# Altium project MHE_Tracker_V2.PrjPcb
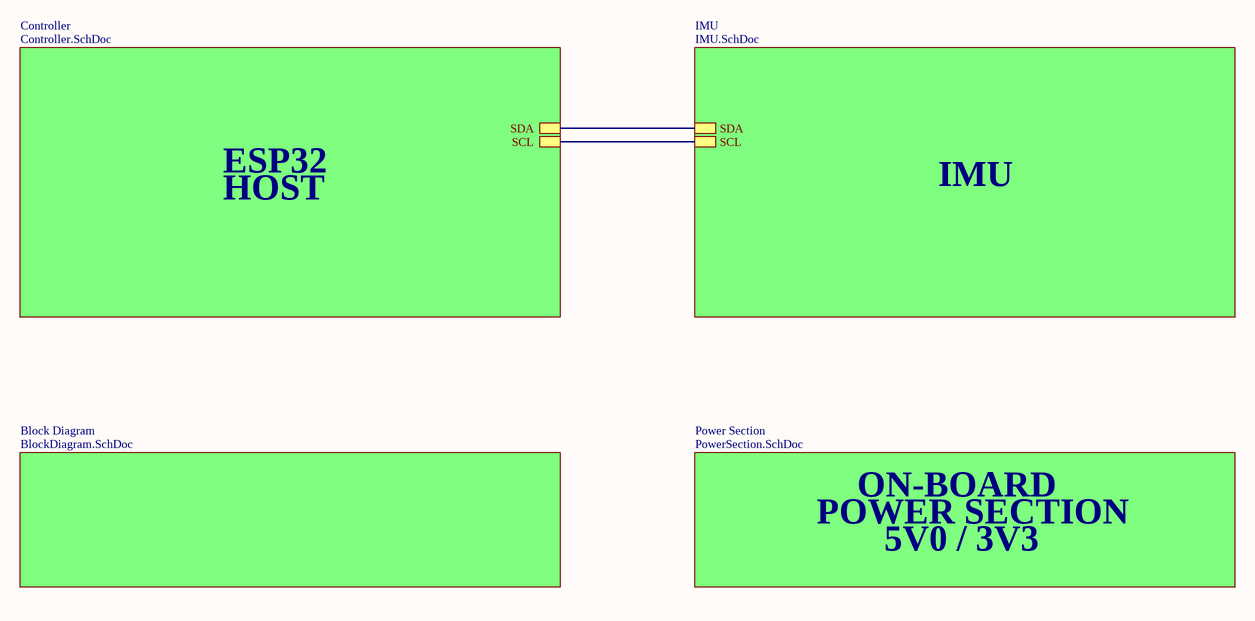
[diagram p0: Architecture.SchDoc]
Project: MHE Tracker V2; Revision: 1.0; SheetTotal: 5
4 sheets, 117 parts. Net scope: hierarchical (ports join the sheet entries above them; power ports are global).
Board file: MHE_Tracker_V2.PcbDoc
Sheets:
  Architecture.SchDoc
    Controller = Controller.SchDoc
    Power Section = PowerSection.SchDoc
    IMU = IMU.SchDoc

## Sheet Architecture.SchDoc: System Architecture
size 420 x 297 mm; SheetNumber: 1; SheetTotal: 2; DOC_NO_SCH_DWG: 1

### Sub-sheets
Block Diagram = BlockDiagram.SchDoc (file not in this document): no entries
Controller = Controller.SchDoc: SDA, SCL
IMU = IMU.SchDoc: SDA, SCL
Power Section = PowerSection.SchDoc: no entries

### Nets
SCL: sheet Controller/SCL, sheet IMU/SCL
SDA: sheet Controller/SDA, sheet IMU/SDA

### Notes on the sheet
- HOST
- ESP32
- IMU
- POWER SECTION
- ON-BOARD
- 5V0 / 3V3
- PROJECT
- SIZE
- FILE NAME
- A3
- TITLE
- SHEET
- OF
- REV

## Sheet Controller.SchDoc: Controller Section
size 420 x 297 mm; SheetNumber: 2
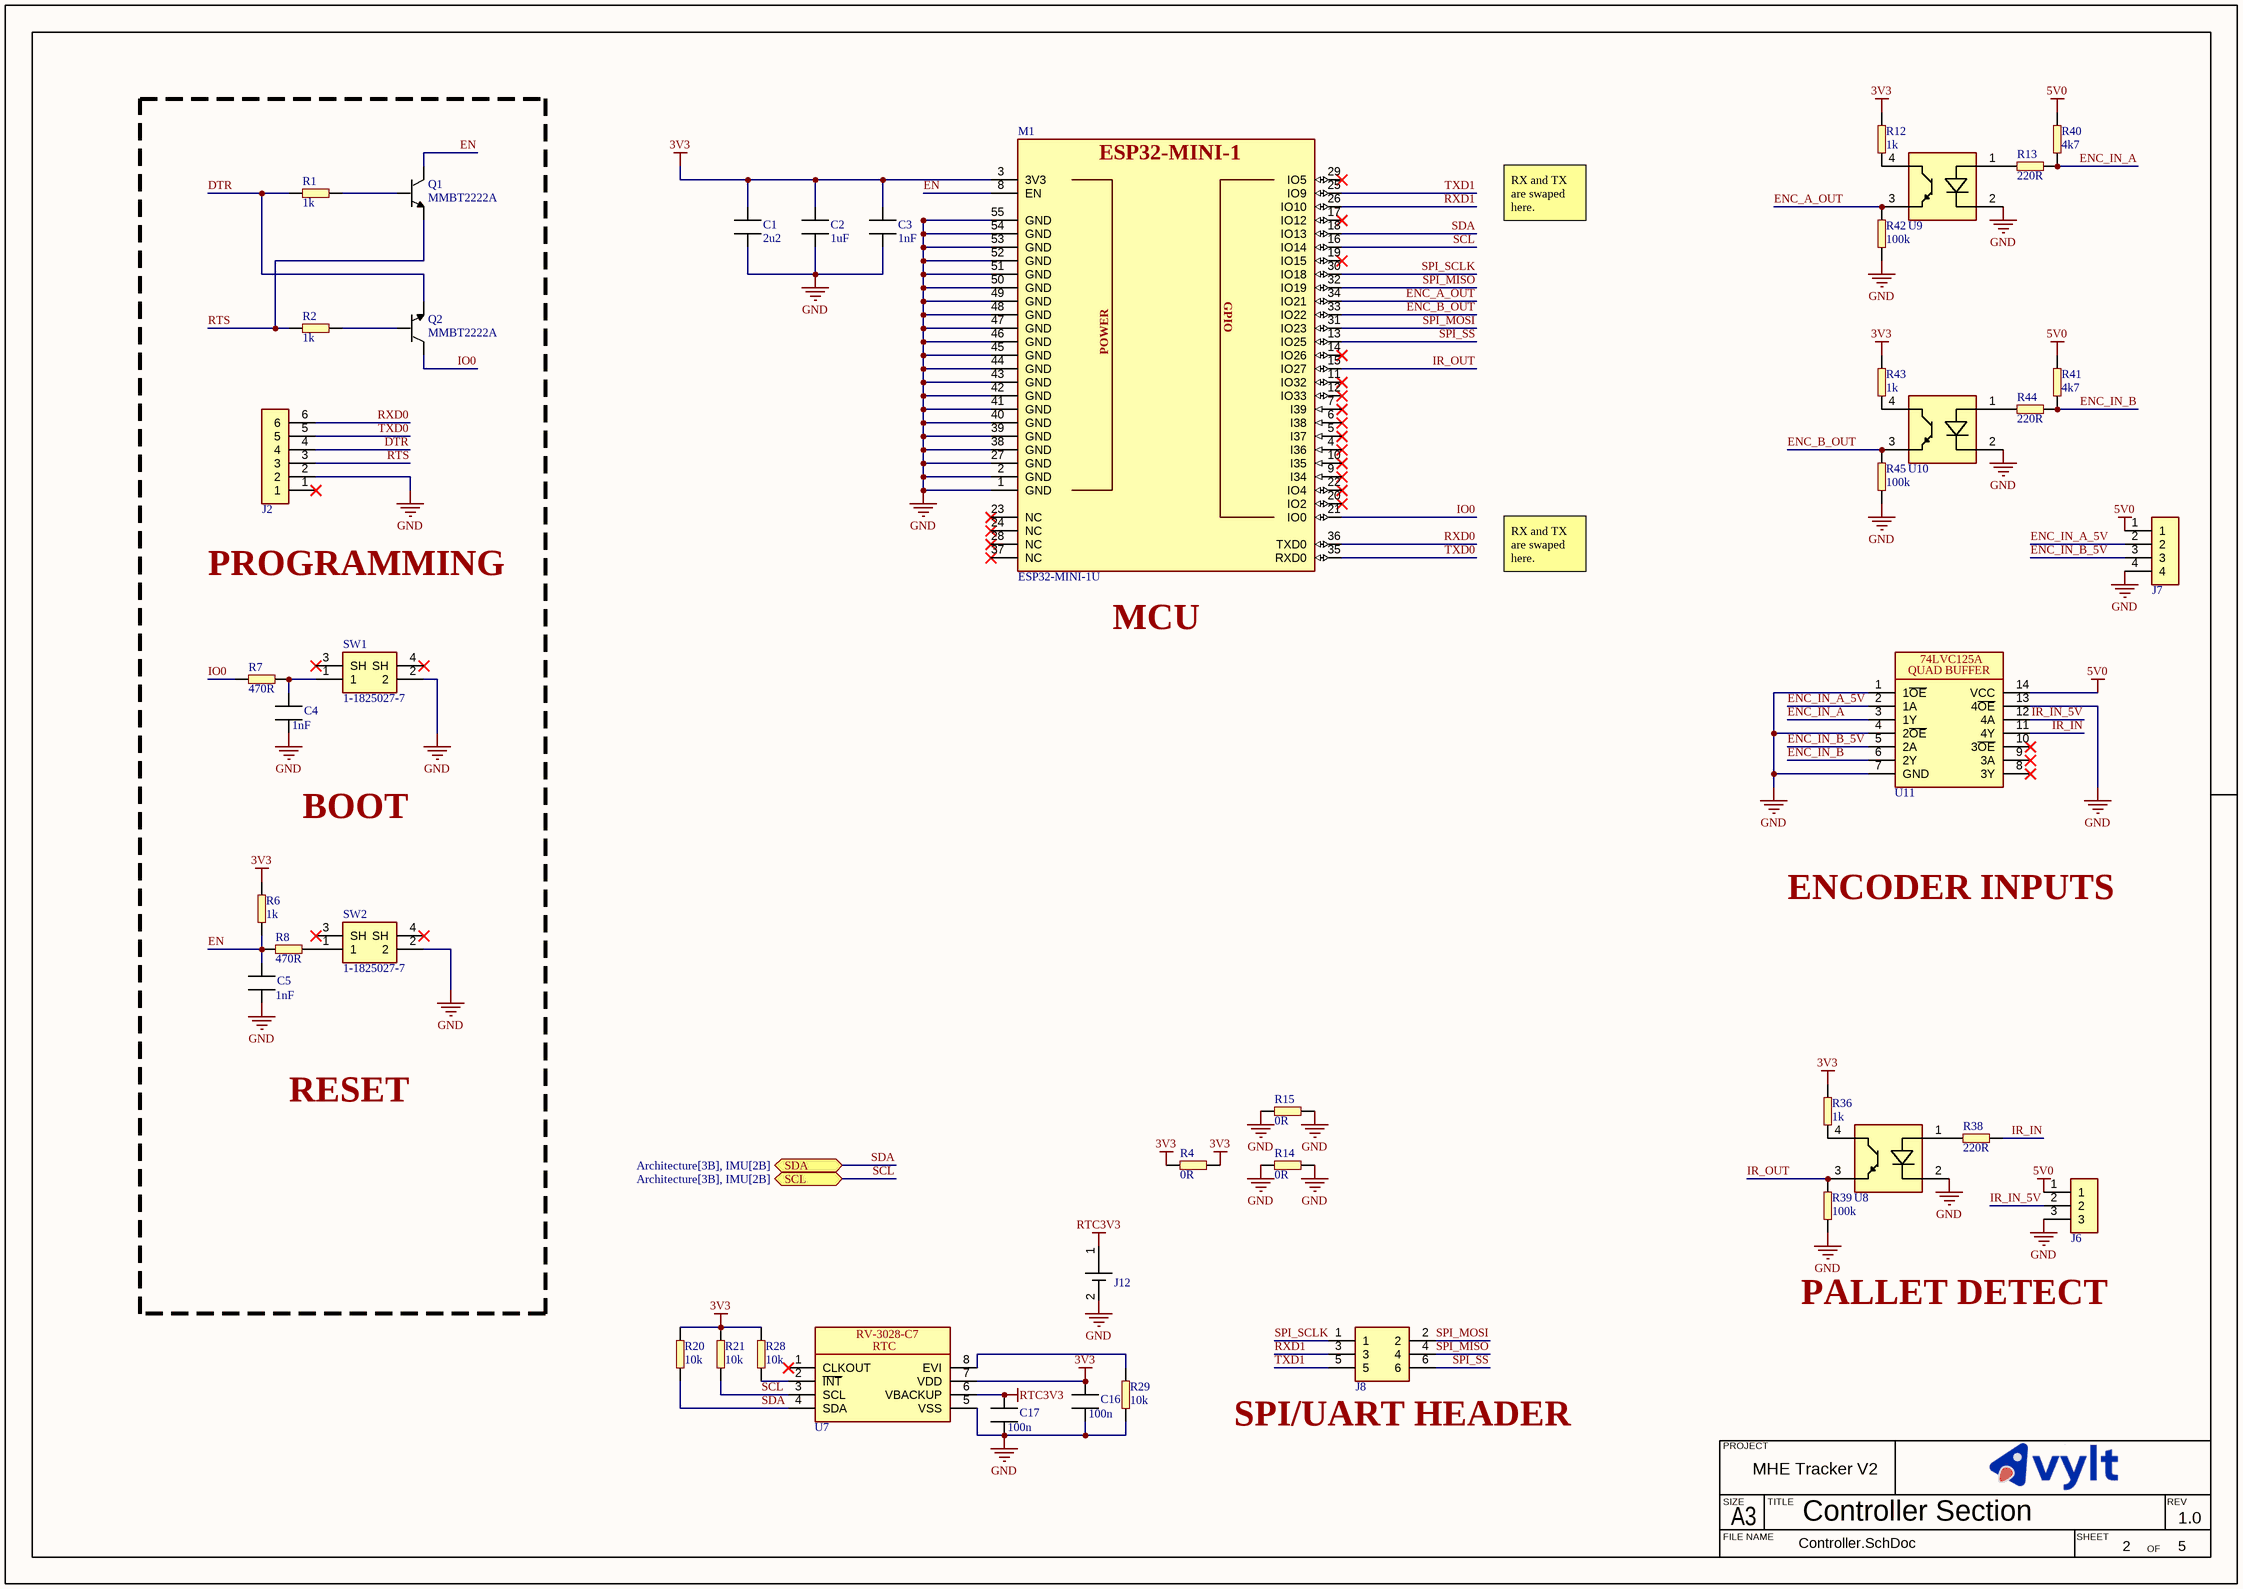
[diagram p1: Controller.SchDoc]

### Parts
(Parts that share a designator on the sheet are numbered #1, #2 ... from top to bottom, then left to right.)
C1  value 2u2  [CAPC1608X10N]  (hidden comment: ERP_102-1)
C2  value 1uF  [CAPC1608X10N]  (hidden comment: ERP_102-1)
C3  value 1nF  [CAPC1608X10N]  (hidden comment: ERP_102-1)
C4  value 1nF  [CAPC1608X10N]  (hidden comment: ERP_102-1)
C5  value 1nF  [CAPC1608X10N]  (hidden comment: ERP_102-1)
C16  value 100n  [CAPC1608X10N]  (hidden comment: ERP_102-1)
C17  value 100n  [CAPC1608X10N]  (hidden comment: ERP_102-1)
J2  ERP_148-2  [6PX1R]  (value not drawn)  (no BOM)
J6#1  Terminal_Block_3Pin_2.54P  [Terminal_Block_3Pin_2.54P]  (value not drawn)
J7#1  Terminal_Block_4Pin_2.54P  [Terminal_Block_4Pin_2.54P]  (value not drawn)
J8#1  6X2_1P27_MH_TH  [6X2_1P27_MH_TH]  (value not drawn)  (no BOM)
J12  CR1220-BH  [CR1220-BH]  (value not drawn)
M1  value ESP32-MINI-1U  [ESP32_MINI_1U]  (hidden comment: ERP_140-3)
Q1  value MMBT2222A  [MMBT2222]  (hidden comment: ERP_105-1)
Q2  value MMBT2222A  [MMBT2222]  (hidden comment: ERP_105-1)
R1  value 1k  [RES_0603]  (hidden comment: ERP_101-1)
R2  value 1k  [RES_0603]  (hidden comment: ERP_101-1)
R4  value 0R  [RESC3115X06N]  (hidden comment: ERP_101-1)
R6  value 1k  [RES_0603]  (hidden comment: ERP_101-1)
R7  value 470R  [RES_0603]  (hidden comment: ERP_101-1)
R8  value 470R  [RES_0603]  (hidden comment: ERP_101-1)
R12  value 1k  [RES_0603]  (hidden comment: ERP_101-1)
R13  value 220R  [RES_0603]  (hidden comment: ERP_101-1)
R14  value 0R  [RESC3115X06N]  (hidden comment: ERP_101-1)
R15  value 0R  [RESC3115X06N]  (hidden comment: ERP_101-1)
R20  value 10k  [RES_0603]  (hidden comment: ERP_101-1)
R21  value 10k  [RES_0603]  (hidden comment: ERP_101-1)
R28  value 10k  [RES_0603]  (hidden comment: ERP_101-1)
R29  value 10k  [RES_0603]  (hidden comment: ERP_101-1)
R36  value 1k  [RES_0603]  (hidden comment: ERP_101-1)
R38  value 220R  [RES_0603]  (hidden comment: ERP_101-1)
R39  value 100k  [RES_0603]  (hidden comment: ERP_101-1)
R40  value 4k7  [RES_0603]  (hidden comment: ERP_101-1)
R41  value 4k7  [RES_0603]  (hidden comment: ERP_101-1)
R42  value 100k  [RES_0603]  (hidden comment: ERP_101-1)
R43  value 1k  [RES_0603]  (hidden comment: ERP_101-1)
R44  value 220R  [RES_0603]  (hidden comment: ERP_101-1)
R45  value 100k  [RES_0603]  (hidden comment: ERP_101-1)
SW1  value 1-1825027-7  [FSM_6X6]  (hidden comment: ERP_110-4)
SW2  value 1-1825027-7  [FSM_6X6]  (hidden comment: ERP_110-4)
U7  RV-3028-C7  [RV-3028-C7]  (value not drawn)
U8  FOD817A3SD  [FOD817A3SD]  (value not drawn)
U9  FOD817A3SD  [FOD817A3SD]  (value not drawn)
U10  FOD817A3SD  [FOD817A3SD]  (value not drawn)
U11  74LVC125ABQ  [74LVC125ABQ]  (value not drawn)

### Ports
SCL (bidir, see Architecture[3B], IMU[2B]), SDA (bidir, see Architecture[3B], IMU[2B])

### Nets
3V3: C1.2 C2.2 C3.2 C16.1 M1.3(3V3) R4.1 R4.2 R6.2 R12.2 R20.2 R21.2 R28.2 R36.2 R43.2 U7.7(VDD)
5V0: J6#1.1 J7#1.1 R40.2 R41.2 U11.14(VCC)
GND: C1.1 C2.1 C3.1 C4.2 C5.2 C16.2 C17.2 J2.2 J6#1.3 J7#1.4 J12.2(-) M1.1(GND) M1.2(GND) M1.27(GND) M1.38(GND) M1.39(GND) M1.40(GND) M1.41(GND) M1.42(GND) M1.43(GND) M1.44(GND) M1.45(GND) M1.46(GND) M1.47(GND) M1.48(GND) M1.49(GND) M1.50(GND) M1.51(GND) M1.52(GND) M1.53(GND) M1.54(GND) M1.55(GND) R14.1 R14.2 R15.1 R15.2 R29.1 R39.1 R42.1 R45.1 SW1.2 SW2.2 U7.5(VSS) U8.2(CATHODE) U9.2(CATHODE) U10.2(CATHODE) U11.1(1~{OE}) U11.4(2~{OE}) U11.7(GND) U11.13(4~{OE})
RTC3V3: C17.1 J12.1(+) U7.6(VBACKUP)
DTR: J2.4 Q2.2 R1.2
EN: C5.1 M1.8(EN) Q1.3 R6.1 R8.2
ENC_A_OUT: M1.34(IO21) R42.2 U9.3(EMITTER)
ENC_B_OUT: M1.33(IO22) R45.2 U10.3(EMITTER)
ENC_IN_A: R13.2 R40.1 U11.3(1Y)
ENC_IN_A_5V: J7#1.2 U11.2(1A)
ENC_IN_B: R41.1 R44.2 U11.6(2Y)
ENC_IN_B_5V: J7#1.3 U11.5(2A)
IO0: M1.21(IO0) Q2.3 R7.2
IR_IN: R38.2 U11.11(4Y)
IR_IN_5V: J6#1.2 U11.12(4A)
IR_OUT: M1.15(IO27) R39.2 U8.3(EMITTER)
RTS: J2.3 Q1.2 R2.2
RXD0: J2.6 M1.36(TXD0)
RXD1: J8#1.3 M1.26(IO10)
SCL: M1.16(IO14) R21.1 U7.3(SCL) ; port SCL
SDA: M1.18(IO13) R20.1 U7.4(SDA) ; port SDA
SPI_MISO: J8#1.4 M1.32(IO19)
SPI_MOSI: J8#1.2 M1.31(IO23)
SPI_SCLK: J8#1.1 M1.30(IO18)
SPI_SS: J8#1.6 M1.13(IO25)
TXD0: J2.5 M1.35(RXD0)
TXD1: J8#1.5 M1.25(IO9)
NetC4_1: C4.1 R7.1 SW1.1
NetQ1_1: Q1.1 R1.1
NetQ2_1: Q2.1 R2.1
NetR8_1: R8.1 SW2.1
NetR12_1: R12.1 U9.4(COLLECTOR)
NetR13_1: R13.1 U9.1(ANODE)
NetR28_1: R28.1 U7.2(~{INT})
NetR29_2: R29.2 U7.8(EVI)
NetR36_1: R36.1 U8.4(COLLECTOR)
NetR38_1: R38.1 U8.1(ANODE)
NetR43_1: R43.1 U10.4(COLLECTOR)
NetR44_1: R44.1 U10.1(ANODE)

Not connected (* = marked no-connect by the designer): J2 1*; M1 4(I36)* 5(I37)* 6(I38)* 7(I39)* 9(I34)* 10(I35)* 11(IO32)* 12(IO33)* 14(IO26)* 17(IO12)* 19(IO15)* 20(IO2)* 22(IO4)* 23(NC)* 24(NC)* 28(NC)* 29(IO5)* 37(NC)*; SW1 3(SH)* 4(SH)*; SW2 3(SH)* 4(SH)*; U7 1(CLKOUT)*; U11 8(3Y)* 9(3A)* 10(3~{OE})*

### Notes on the sheet
- RX and TX are swaped here.
- PROGRAMMING
- (near M1) MCU
- BOOT
- ENCODER INPUTS
- RESET
- PALLET DETECT
- (near J8#1) SPI/UART HEADER
- PROJECT
- SIZE
- FILE NAME
- A3
- TITLE
- SHEET
- OF
- REV
- (in symbol 74LVC125ABQ) 74LVC125A; QUAD BUFFER
- (in symbol ESP32_MINI_1) ESP32-MINI-1; GPIO; POWER
- (in symbol RV-3028-C7) RTC

### Library data of the parts
C1 = MLCC_0603: MLCC 0603; Manufacturer 1: Murata Electronics; Manufacturer Part Number 1: GRT188R61H225KE13D; Package: 0603; Suuplier Part Number 1: *; ERP: *; Supplier 1: Digikey; Supplier Part Number 1: 490-12332-1-ND
C2 = MLCC_0603: MLCC 0603; Manufacturer 1: Samsung Electro-Mechanics; Manufacturer Part Number 1: CL10A105KB8NNNC; Package: 0603; Supplier 1: *; Suuplier Part Number 1: *; ERP: *
C3-C5 = MLCC_0603: MLCC 0603; Manufacturer 1: Samsung Electro-Mechanics; Manufacturer Part Number 1: CL10C102JB8NNNC; Package: 0603; Suuplier Part Number 1: *; ERP: *; Supplier 1: Digikey; Supplier Part Number 1: 1276-1091-1-ND
C16 C17 = MLCC_0603: MLCC 0603; Package: 0603; Manufacturer Part Number 1: *; Suuplier Part Number 1: *; ERP: *
  C17: Manufacturer 1: *
J2 = 6PX1R
J6#1 = Terminal_Block_3Pin_2.54P: TERMINAL BLOCK 3 PIN 2.54 PITCH; Manufacturer Part Number 1: *; Manufacturer 1: *; Value: *
J7#1 = Terminal_Block_4Pin_2.54P: TERMINAL BLOCK 4 PIN 2.54 PITCH; Manufacturer Part Number 1: *; Manufacturer 1: *; Value: *
J8#1 = 6X2_1P27_MH_TH: Manufacturer Part Number 1: HPH2-A-06-UA; Manufacturer 1: Adam Tech; Value: *
J12 = CR1220-BH: BATTERY HOLDER COIN 12.5MM SMD; Manufacturer 1: Keystone Electronics; Value: *; Manufacturer Part Number 1: *
M1 = ESP32_MINI_1: ESP32_C3_MINI_1 Module; Manufacturer Part Number 1: ESP32-MINI-1U-N4; Manufacturer 1: Espressif Systems; ERP: *; Package: 56 PIN SMD; Supplier 1: Digikey; Supplier Part Number 1: 1965-ESP32-MINI-1U-N4CT-ND
Q1 Q2 = MMBT2222: MMBT2222A; Manufacturer Part Number 1: MMBT2222A-7-F; Manufacturer 1: Diotec Semiconductor; ERP: *; Suuplier Part Number 1: *; Supplier 1: *; Package: SOT23
R1 R2 R6 R12 R13 R36 R38 R40 R41 R43 R44 = RES_0603: Manufacturer 1: YAGEO; Manufacturer Part Number 1: RC0603FR-071KL; Package: 0603; ERP: *
R4 R14 R15 = RES_1206: Package: 1206; Manufacturer 1: *; Manufacturer Part Number 1: *; Supplier  1: *; Supplier  Part Number 1: *; ERP: *
R7 R8 = RES_0603: Manufacturer 1: YAGEO; Manufacturer Part Number 1: RC0603JR-07470RL; Package: 0603; ERP: *; Supplier 1: *; Supplier Part Number 1: *; Supplier 2: Digikey; Supplier Part Number 2: 311-470GRCT-ND
R20 R21 R28 R29 R39 = RES_0603: Package: 0603; Manufacturer 1: *; Manufacturer Part Number 1: *; ERP: *
  R20 R21 R28 R29: Supplier 1: *; Supplier Part Number 1: *
R42 R45 = RES_0603: Manufacturer Part Number 1: RC0603FR-07100KL; Package: 0603; Manufacturer 1: *; ERP: *
SW1 SW2 = FSM_6X6: Manufacturer 1: TE; ERP: *; Suuplier Part Number 1: *; Manufacturer Part Number 1: 1-1825027-7; Package: 6X6; Supplier 1: Digikey; Supplier Part Number 1: 450-1660-ND
U7 = RV-3028-C7: IC RTC CLK/CALENDAR I2C 8SON; Manufacturer 1: Micro Crystal AG; Manufacturer Part Number 1: RV-3028-C7 32.768KHZ 1PPM-TA-QC; Value: *
U8-U10 = FOD817A3SD: OPTOISOLATOR 5KV TRANSISTOR 4SMD; Manufacturer: onsemi; Value: *; Manufacturer Part Number 1: FOD817A3SD
U11 = 74LVC125ABQ: IC BUF NON-INVERT 3.6V 14DHVQFN; Manufacturer Part Number 1: 74LVC125ABQ,115; Manufacturer 1: Nexperia USA Inc.

## Sheet PowerSection.SchDoc: Power Section
size 420 x 297 mm; SheetNumber: 3
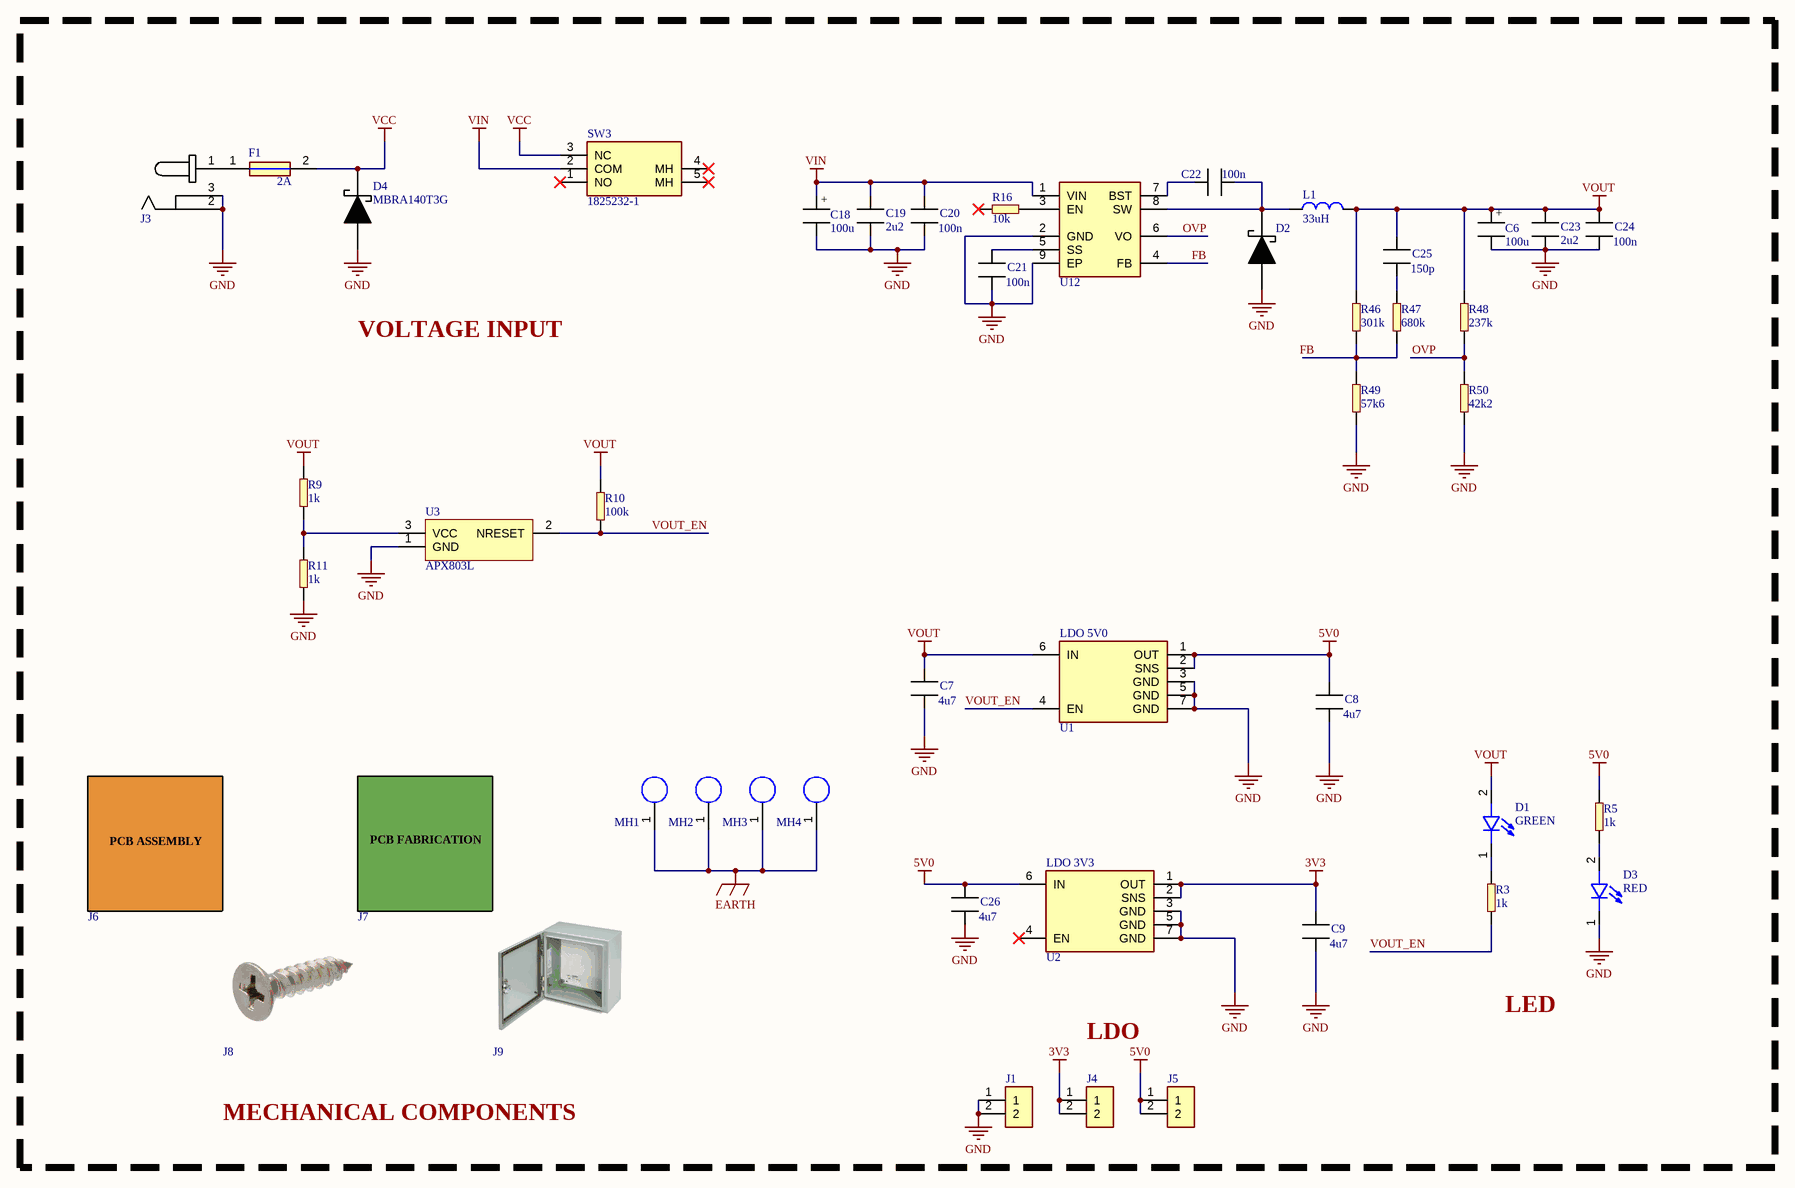
[diagram p2: PowerSection.SchDoc]

### Parts
(Parts that share a designator on the sheet are numbered #1, #2 ... from top to bottom, then left to right.)
C6  value 100u  [CAP_12.5_14]  (hidden comment: CAP_12.5_14)
C7  value 4u7  [CAPC1608X10N]  (hidden comment: ERP_102-1)
C8  value 4u7  [CAPC1608X10N]  (hidden comment: ERP_102-1)
C9  value 4u7  [CAPC1608X10N]  (hidden comment: ERP_102-1)
C18  value 100u  [CAP_12.5_14]  (hidden comment: CAP_12.5_14)
C19  value 2u2  [CAPC1608X10N]  (hidden comment: ERP_102-1)
C20  value 100n  [CAPC1608X10N]  (hidden comment: ERP_102-1)
C21  value 100n  [CAPC1608X10N]  (hidden comment: ERP_102-1)
C22  value 100n  [CAPC1608X10N]  (hidden comment: ERP_102-1)
C23  value 2u2  [CAPC1608X10N]  (hidden comment: ERP_102-1)
C24  value 100n  [CAPC1608X10N]  (hidden comment: ERP_102-1)
C25  value 150p  [CAPC1608X10N]  (hidden comment: ERP_102-1)
C26  value 4u7  [CAPC1608X10N]  (hidden comment: ERP_102-1)
D1  value GREEN  [LED_2SMD]  (hidden comment: LED_2SMD)
D2  ERP_104-3  [B560C-13-F]  (value not drawn)
D3  value RED  [LED_2SMD]  (hidden comment: LED_2SMD)
D4  value MBRA140T3G  [SS14_SMA]  (hidden comment: ERP_104-3)  (graphical)
F1  value 2A  [0679L]  (hidden comment: 0679L)
J1  ERP_148-2  [2PX1R]  (value not drawn)  (no BOM)
J3  KLDX-0202-AC  [KLDX-0202-AC]  (value not drawn)
J4  ERP_148-2  [2PX1R]  (value not drawn)  (no BOM)
J5  ERP_148-2  [2PX1R]  (value not drawn)  (no BOM)
J6#2  APCB  (value not drawn)  (graphical)
J7#2  BPCB  (value not drawn)  (graphical)
J8#2  SCREW  (value not drawn)  (graphical)
J9  ENCLOSURE  (value not drawn)  (graphical)
L1  value 33uH  [IND_1212]  (hidden comment: ERP_103-3)
MH1  MountingHole4X6  [MountingHole4X6]  (value not drawn)  (graphical)
MH2  MountingHole4X6  [MountingHole4X6]  (value not drawn)  (graphical)
MH3  MountingHole4X6  [MountingHole4X6]  (value not drawn)  (graphical)
MH4  MountingHole4X6  [MountingHole4X6]  (value not drawn)  (graphical)
R3  value 1k  [RES_0603]  (hidden comment: ERP_101-1)
R5  value 1k  [RES_0603]  (hidden comment: ERP_101-1)
R9  value 1k  [RES_0603]  (hidden comment: ERP_101-1)
R10  value 100k  [RES_0603]  (hidden comment: ERP_101-1)
R11  value 1k  [RES_0603]  (hidden comment: ERP_101-1)
R16  value 10k  [RES_0603]  (hidden comment: ERP_101-1)  (no BOM)
R46  value 301k  [RES_0603]  (hidden comment: ERP_101-1)
R47  value 680k  [RES_0603]  (hidden comment: ERP_101-1)
R48  value 237k  [RES_0603]  (hidden comment: ERP_101-1)
R49  value 57k6  [RES_0603]  (hidden comment: ERP_101-1)
R50  value 42k2  [RES_0603]  (hidden comment: ERP_101-1)
SW3  value 1825232-1  [3PIN_SPDT_TH_RA]  (hidden comment: ERP_110-4)
U1  value LDO 5V0  [TLV767XXDRV]  (hidden comment: TLV767XXDRV)
U2  value LDO 3V3  [TLV767XXDRV]  (hidden comment: TLV767XXDRV)
U3  APX803L  [APX803L]
U12  MP24943DN  [MP24943DN]  (value not drawn)

### Nets
3V3: C9.1 J4.1 J4.2 U2.1(OUT) U2.2(SNS)
5V0: C8.1 C26.1 J5.1 J5.2 R5.1 U1.1(OUT) U1.2(SNS) U2.6(IN)
EARTH: MH1.1 MH2.1 MH3.1 MH4.1
GND: C6.2 C7.2 C8.2 C9.2 C18.2 C19.1 C20.2 C21.2 C23.1 C24.2 C26.2 D2.2(A) D3.1 D4.2(A) J1.1 J1.2 J3.2 J3.3 R11.1 R49.1 R50.1 U1.3(GND) U1.5(GND) U1.7(GND) U2.3(GND) U2.5(GND) U2.7(GND) U3.1(GND) U12.2(GND) U12.9(EP)
VCC: D4.1(C) F1.2 SW3.3(NC)
VIN: C18.1 C19.2 C20.1 SW3.2(COM) U12.1(VIN)
VOUT: C6.1 C7.1 C23.2 C24.1 C25.1 D1.2 L1.2 R9.2 R10.2 R46.2 R48.2 U1.6(IN)
FB: R46.1 R47.1 R49.2 U12.4(FB)
OVP: R48.1 R50.2 U12.6(VO)
VOUT_EN: R3.1 R10.1 U1.4(EN) U3.2(NRESET)
NetC21_1: C21.1 U12.5(SS)
NetC22_1: C22.1 U12.7(BST)
NetC22_2: C22.2 D2.1(C) L1.1 U12.8(SW)
NetC25_2: C25.2 R47.2
NetD1_1: D1.1 R3.2
NetD3_2: D3.2 R5.2
NetF1_1: F1.1 J3.1
NetR9_1: R9.1 R11.2 U3.3(VCC)
NetR16_1: R16.1 U12.3(EN)

Not connected (* = marked no-connect by the designer): R16 2*; SW3 1(NO)* 4(MH)* 5(MH)*; U2 4(EN)*

### Notes on the sheet
- VOLTAGE INPUT
- LDO
- LED
- MECHANICAL COMPONENTS
- PROJECT
- SIZE
- FILE NAME
- A3
- TITLE
- SHEET
- OF
- REV
- (in symbol APCB) PCB ASSEMBLY
- (in symbol BPCB) PCB FABRICATION
- (in symbol CAP_12.5_14) +

### Library data of the parts
C6 C18 = CAP_12.5_14: Electrolytic Capacitor SMD; Manufacturer 1: KEMET; Manufacturer Part Number 1: EDH107M100A9RAA
C7-C9 C26 = MLCC_0603: MLCC 0603; Manufacturer 1: Murata; Manufacturer Part Number 1: GRM188R6YA475KE15D; Package: 0603; Suuplier Part Number 1: *; ERP: *; Supplier 1: Digikey; Supplier Part Number 1: 490-7205-1-ND
C19 C23 = MLCC_0603: as C1 on sheet Controller; Package: 0603; Suuplier Part Number 1: *; ERP: *; Supplier 1: Digikey; Supplier Part Number 1: 490-12332-1-ND
C20-C22 C24 C25 = MLCC_0603: Chip Capacitor, 2-Leads, Body 1.60x0.80mm, IPC Medium Density; Package: 0603; Manufacturer 1: *; Manufacturer Part Number 1: *; Supplier 1: *; Suuplier Part Number 1: *; ERP: *
D1 = LED_2SMD: LED GREEN CLEAR 1204 SMD R/A; Manufacturer Part Number 1: 155124VS73200; Manufacturer 1: Würth Elektronik; ERP: *; Suuplier Part Number 1: *; Supplier 1: Digikey; Package: 1204
D2 = B560C-13-F: Manufacturer 1: Diodes Incorporated; Manufacturer Part Number 1: *; Value: B560C-13-F
D3 = LED_2SMD: LED RED CLEAR 1204 SMD R/A; Manufacturer Part Number 1: 155124RS73200; Manufacturer 1: Würth Elektronik; ERP: *; Suuplier Part Number 1: *; Supplier 1: Digikey; Package: 1204
D4 = SS14_SMA: Manufacturer 1: ONSEMi; Supplier Part Number 1: *; Supplier  1: *; Package: SMA; Manufacturer Part Number 1: MBRA140T3G; ERP: *; Supplier 1: Digikey; Supplier Part Number 1: MBRA140T3GOSCT-ND
F1 = 0679L: FUSE BRD MNT 2SMD; Manufacturer Part Number 1: 0679L2000-05; Manufacturer 1: Bel Fuse Inc.
J1 J4 J5 = 2PX1R
J3 = KLDX-0202-AC: CONN PWR JACK 2X5.5MM KINKED PIN; Manufacturer 1: Kycon, Inc.; Value: NA; Manufacturer Part Number 1: KLDX-0202-AC
J6#2 = APCB: Assembled PCB; Value: *; Manufacturer 1: *; Manufacturer Part Number 1: *
J7#2 = BPCB: Bare PCB; Manufacturer Part Number 1: *; Manufacturer 1: *; Value: *
J8#2 = SCREW: Mounting Screw
J9 = ENCLOSURE: PCB Enclosure; Manufacturer Part Number 1: *; Manufacturer 1: *; Value: *
L1 = IND_1212: Manufacturer Part Number 1: 7447709330; Manufacturer 1: Würth Elektronik
R3 R5 R9 R11 = RES_0603: as R1 on sheet Controller; Package: 0603; ERP: *
R10 = RES_0603: as R42 on sheet Controller; Package: 0603; Manufacturer 1: *; Supplier 1: *; Supplier Part Number 1: *; ERP: *
R16 = RES_0603: Package: 0603; Manufacturer 1: *; Manufacturer Part Number 1: *; Supplier 1: *; Supplier Part Number 1: *; ERP: *
R46 = RES_0603: Manufacturer 1: YAGEO; Manufacturer Part Number 1: RC0603FR-07301KL; Package: 0603; Supplier 1: *; Supplier Part Number 1: *; ERP: *
R47 = RES_0603: Manufacturer 1: YAGEO; Manufacturer Part Number 1: RC0603FR-07680KL; Package: 0603; Supplier 1: *; Supplier Part Number 1: *; ERP: *
R48 = RES_0603: Manufacturer 1: YAGEO; Manufacturer Part Number 1: AC0603FR-07237KL; Package: 0603; Supplier 1: *; Supplier Part Number 1: *; ERP: *
R49 = RES_0603: Manufacturer 1: YAGEO; Manufacturer Part Number 1: RC0603FR-0757K6L; Package: 0603; Supplier 1: *; Supplier Part Number 1: *; ERP: *
R50 = RES_0603: Manufacturer 1: YAGEO; Manufacturer Part Number 1: RC0603FR-0742K2L; Package: 0603; Supplier 1: *; Supplier Part Number 1: *; ERP: *
SW3 = 3PIN_SPDT_TH_RA: Manufacturer 1: TE; ERP: *; Manufacturer Part Number 1: 1825232-1; Package: 6X6; Supplier 1: *; Supplier Part Number 1: *; Supplier 2: Digikey; Supplier Part Number 2: A107673-ND
U1 = TLV767XXDRV: IC REG LINEAR; Manufacturer Part Number 1: TLV76750DRVR; Manufacturer 1: Texas Instruments
U2 = TLV767XXDRV: IC REG LINEAR; Manufacturer Part Number 1: TLV76733DRVR; Manufacturer 1: Texas Instruments
U3 = APX803L: IC SUPERVISOR 1 CHANNEL SOT23; Manufacturer Part Number 1: APX803L20-35SA-7; Manufacturer 1: Diodes Incorporated; Value: APX803L
U12 = MP24943DN: IC REG BUCK ADJ 3A 8SOIC; Manufacturer 1: Monolithic Power Systems Inc.; Manufacturer Part Number 1: MP24943DN-LF-Z; Value: *

## Sheet IMU.SchDoc: IMU
size 420 x 297 mm; SheetNumber: 5
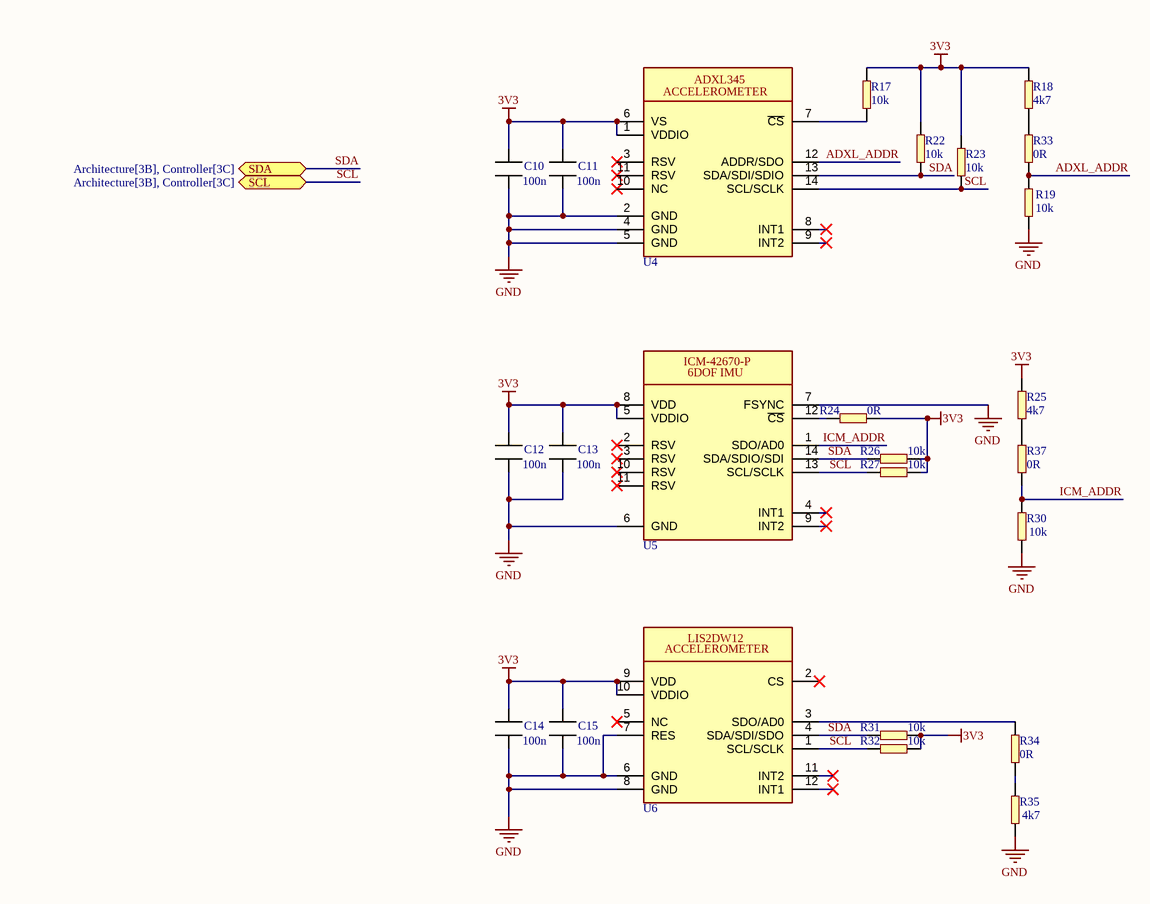
[diagram p3: IMU.SchDoc]

### Parts
C10  value 100n  [CAPC1608X10N]  (hidden comment: ERP_102-1)
C11  value 100n  [CAPC1608X10N]  (hidden comment: ERP_102-1)
C12  value 100n  [CAPC1608X10N]  (hidden comment: ERP_102-1)
C13  value 100n  [CAPC1608X10N]  (hidden comment: ERP_102-1)
C14  value 100n  [CAPC1608X10N]  (hidden comment: ERP_102-1)
C15  value 100n  [CAPC1608X10N]  (hidden comment: ERP_102-1)
R17  value 10k  [RES_0603]  (hidden comment: ERP_101-1)
R18  value 4k7  [RES_0603]  (hidden comment: ERP_101-1)
R19  value 10k  [RES_0603]  (hidden comment: ERP_101-1)
R22  value 10k  [RES_0603]  (hidden comment: ERP_101-1)
R23  value 10k  [RES_0603]  (hidden comment: ERP_101-1)
R24  value 0R  [RES_0603]  (hidden comment: ERP_101-1)
R25  value 4k7  [RES_0603]  (hidden comment: ERP_101-1)
R26  value 10k  [RES_0603]  (hidden comment: ERP_101-1)
R27  value 10k  [RES_0603]  (hidden comment: ERP_101-1)
R30  value 10k  [RES_0603]  (hidden comment: ERP_101-1)
R31  value 10k  [RES_0603]  (hidden comment: ERP_101-1)
R32  value 10k  [RES_0603]  (hidden comment: ERP_101-1)
R33  value 0R  [RES_0603]  (hidden comment: ERP_101-1)  (no BOM)
R34  value 0R  [RES_0603]  (hidden comment: ERP_101-1)  (no BOM)
R35  value 4k7  [RES_0603]  (hidden comment: ERP_101-1)
R37  value 0R  [RES_0603]  (hidden comment: ERP_101-1)  (no BOM)
U4  ADXL345  [ADXL345]  (value not drawn)
U5  ICM42670P  [ICM42670P]  (value not drawn)
U6  LIS2DW12  [LIS2DW12]  (value not drawn)

### Ports
SCL (bidir, see Architecture[3B], Controller[3C]), SDA (bidir, see Architecture[3B], Controller[3C])

### Nets
3V3: C10.1 C11.1 C12.1 C13.1 C14.1 C15.1 R17.2 R18.2 R22.2 R23.2 R24.1 R25.2 R26.1 R27.1 R31.1 R32.1 U4.1(VDDIO) U4.6(VS) U5.5(VDDIO) U5.8(VDD) U6.9(VDD) U6.10(VDDIO)
GND: C10.2 C11.2 C12.2 C13.2 C14.2 C15.2 R19.1 R30.1 R35.1 U4.2(GND) U4.4(GND) U4.5(GND) U5.6(GND) U5.7(FSYNC) U6.6(GND) U6.7(RES) U6.8(GND)
ADXL_ADDR: R19.2 R33.1 U4.12(ADDR/SDO)
ICM_ADDR: R30.2 R37.1 U5.1(SDO/AD0)
SCL: R23.1 R27.2 R32.2 U4.14(SCL/SCLK) U5.13(SCL/SCLK) U6.1(SCL/SCLK) ; port SCL
SDA: R22.1 R26.2 R31.2 U4.13(SDA/SDI/SDIO) U5.14(SDA/SDIO/SDI) U6.4(SDA/SDI/SDO) ; port SDA
NetR17_1: R17.1 U4.7(~{CS})
NetR18_1: R18.1 R33.2
NetR24_2: R24.2 U5.12(~{CS})
NetR25_1: R25.1 R37.2
NetR34_1: R34.1 R35.2
NetR34_2: R34.2 U6.3(SDO/AD0)

Not connected (* = marked no-connect by the designer): U4 3(RSV)* 8(INT1)* 9(INT2)* 10(NC)* 11(RSV)*; U5 2(RSV)* 3(RSV)* 4(INT1)* 9(INT2)* 10(RSV)* 11(RSV)*; U6 2(CS)* 5(NC)* 11(INT2)* 12(INT1)*

### Notes on the sheet
- PROJECT
- SIZE
- FILE NAME
- A3
- TITLE
- SHEET
- OF
- REV
- (in symbol ADXL345) ACCELEROMETER
- (in symbol ICM42670P) 6DOF IMU
- (in symbol LIS2DW12) ACCELEROMETER

### Library data of the parts
C10-C15 = MLCC_0603: as C20 on sheet PowerSection; Package: 0603; Manufacturer 1: *; Manufacturer Part Number 1: *; Supplier 1: *; Suuplier Part Number 1: *; ERP: *
R17-R19 R22-R27 R30-R35 R37 = RES_0603: Package: 0603; Manufacturer 1: *; Manufacturer Part Number 1: *; Supplier 1: *; Supplier Part Number 1: *; ERP: *
U4 = ADXL345: ACCEL 2-16G I2C/SPI 14LGA; Manufacturer 1: Analog Devices Inc.; Manufacturer Part Number 1: ADXL345BCCZ-RL7; Value: *
U5 = ICM42670P: IMU ACCEL/GYRO/TEMP I2C/SPI; Manufacturer Part Number 1: ICM-42670-P; Manufacturer 1: TDK InvenSense; Value: *
U6 = LIS2DW12: ACCEL 2-16G I2C/SPI 12LGA; Manufacturer 1: STMicroelectronics; Value: *; Manufacturer Part Number 1: *

## Nets that join several sheets
3V3: Controller (15 pins), PowerSection (5 pins), IMU (22 pins)
5V0: Controller (5 pins), PowerSection (8 pins)
GND: Controller (50 pins), PowerSection (30 pins), IMU (17 pins)
SCL: Controller (M1.16 R21.1 U7.3), IMU (6 pins)
SDA: Controller (M1.18 R20.1 U7.4), IMU (6 pins)